# EAGLE design controle_com_2dimmer (EAGLE 6.4)

## Sheet 1 of 2
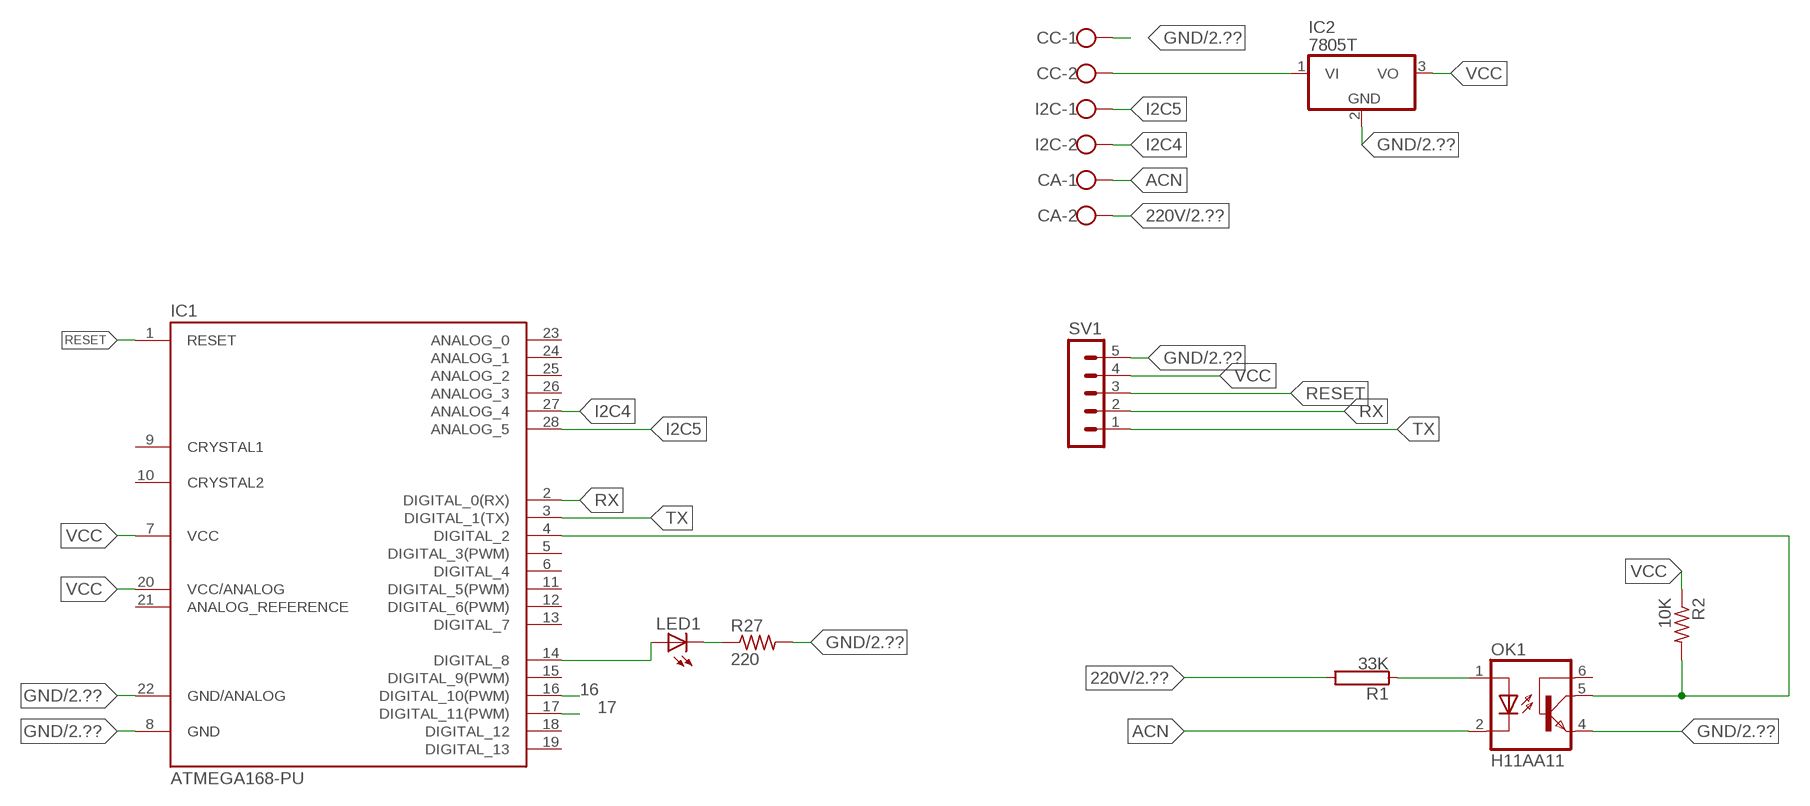
[diagram p0: schematic, sheet 1]

### Parts
CA  W237-102  [W237-102]
CC  W237-102  [W237-102]
I2C  W237-102  [W237-102]
IC1  ATMEGA168-PU  [DIL28-3]
IC2  7805T  [TO220H]
LED1  LED3MM  [LED3MM]
OK1  H11AA11  [DIL06]
R1  33K  RKH206-8R  [KH206-8R]
R2  10K  R-US_0207/7  [0207/7]
R27  220  R-US_0207/7  [0207/7]
SV1  MA05-1  [MA05-1]

### Nets
16: IC1.16(DIGITAL_10(PWM)) ; also sheet 2
17: IC1.17(DIGITAL_11(PWM)) ; also sheet 2
220V: CA.2 R1.2 ; also sheet 2
ACN: CA.1 OK1.2(C)
DIG02: IC1.4(DIGITAL_2) OK1.5(COL) R2.2
GND: CC.1 IC1.8(GND) IC1.22(GND/ANALOG) IC2.2(GND) OK1.4(EMI) R27.2 SV1.5 ; also sheet 2
I2C4: I2C.2 IC1.27(ANALOG_4)
I2C5: I2C.1 IC1.28(ANALOG_5)
N$6: OK1.1(A) R1.1
N$7: LED1.K(C) R27.1
N$12: CC.2 IC2.1(VI)
N$26: IC1.14(DIGITAL_8) LED1.A
RESET: IC1.1(RESET) SV1.3
RX: IC1.2(DIGITAL_0(RX)) SV1.2
TX: IC1.3(DIGITAL_1(TX)) SV1.1
VCC: IC1.7(VCC) IC1.20(VCC/ANALOG) IC2.3(VO) R2.1 SV1.4
Unconnected: IC1.5(DIGITAL_3(PWM)) IC1.6(DIGITAL_4) IC1.9(CRYSTAL1) IC1.10(CRYSTAL2) IC1.11(DIGITAL_5(PWM)) IC1.12(DIGITAL_6(PWM)) IC1.13(DIGITAL_7) IC1.15(DIGITAL_9(PWM)) IC1.18(DIGITAL_12) IC1.19(DIGITAL_13) IC1.21(ANALOG_REFERENCE) IC1.23(ANALOG_0) IC1.24(ANALOG_1) IC1.25(ANALOG_2) IC1.26(ANALOG_3) OK1.6(BAS)

## Sheet 2 of 2
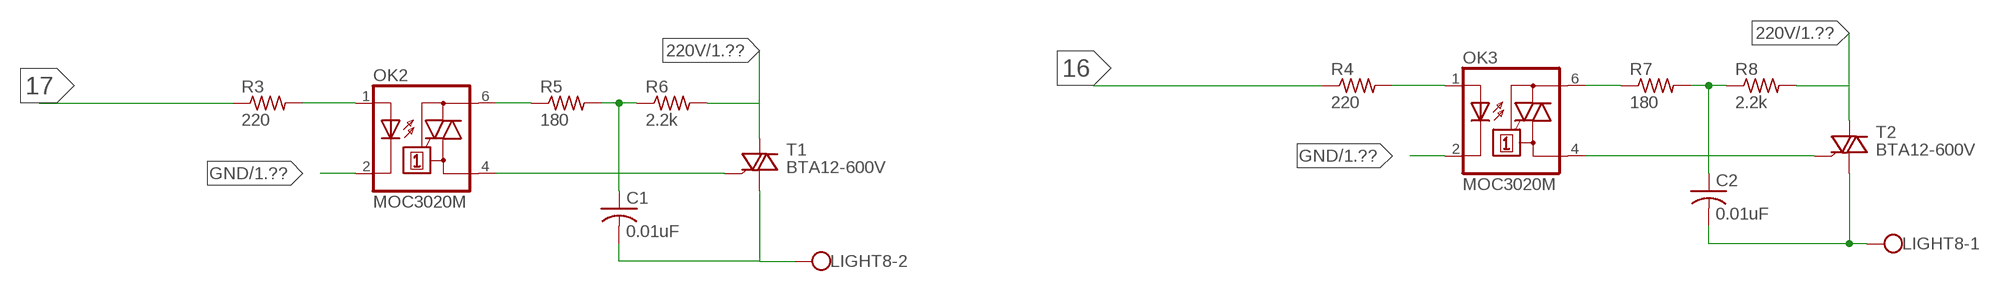
[diagram p1: schematic, sheet 2]

### Parts
C1  0.01uF  C-US075-042X103  [C075-042X103]
C2  0.01uF  C-US075-042X103  [C075-042X103]
LIGHT8  W237-102  [W237-102]
OK2  MOC3020M  [DIL06]
OK3  MOC3020M  [DIL06]
R3  220  R-US_0207/7  [0207/7]
R4  220  R-US_0207/7  [0207/7]
R5  180  R-US_0309/10  [0309/10]
R6  2.2k  R-US_0309/10  [0309/10]
R7  180  R-US_0309/10  [0309/10]
R8  2.2k  R-US_0309/10  [0309/10]
T1  BTA12-600V  [TO220V]
T2  BTA12-600V  [TO220V]

### Nets
16: R4.1 ; also sheet 1
17: R3.1 ; also sheet 1
220V: R6.2 R8.2 T1.2(A2) T2.2(A2) ; also sheet 1
GND: OK2.2(C) OK3.2(C) ; also sheet 1
N$2: OK3.1(A) R4.2
N$3: OK2.1(A) R3.2
N$5: C1.1 R5.2 R6.1
N$8: OK2.6(A2) R5.1
N$9: C1.2 LIGHT8.2 T1.1(A1)
N$10: OK2.4(A1) T1.3(G)
N$11: C2.1 R7.2 R8.1
N$13: OK3.6(A2) R7.1
N$14: C2.2 LIGHT8.1 T2.1(A1)
N$15: OK3.4(A1) T2.3(G)

## Library data of the parts
C1 C2 = adafruit:C-US: CAPACITOR, American symbol
CA CC I2C LIGHT8 = con-wago-500:W237-102: WAGO SCREW CLAMP; MPN: 237-102; OC_FARNELL: unknown; OC_NEWARK: 70K9898
IC1 = Arduino-AVR:ATMEGA168-PU
IC2 = linear:78*: Positive VOLTAGE REGULATOR Source: http://cache.national.com/ds/LM/LM78L05.pdf http://www.fairchildsemi.com/ds/LM/LM7805.pdf
LED1 = led:LED: LED OSRAM: - CHIPLED LG R971, LG N971, LY N971, LG Q971, LY Q971, LO R971, LY R971 LH N974, LH R974 LS Q976, LO Q976, LY Q976 LO Q996 - Hyper CHIPLED LW Q18S LB Q993, LB Q99A, LB R99A - SideLED LS A670, LO A670, LY A670, LG A670, LP A670 LB A673, LV A673, LT A673, LW A673 LH A674 LY A675 LS A676, LA A676, LO A676, LY A676, LW A676 LS A679, LY A679, LG A679 - Hyper Micro SIDELED® LS Y876, LA Y876, LO Y876, LY Y876 LT Y87S - SmartLED LW L88C, LW L88S LB L89C, LB L89S, LG L890 LS L89K, LO L89K, LY L89K LS L896, LA L896, LO L896, LY L896 - TOPLED LS T670, LO T670, LY T670, LG T670, LP T670 LSG T670, LSP T670, LSY T670, LOP T670, LYG T670 LG T671, LOG T671, LSG T671 LB T673, LV T673, LT T673, LW T673 LH T674 LS T676, LA T676, LO T676, LY T676, LB T676, LH T676, LSB T676, LW T676 LB T67C, LV T67C, LT T67C, LS T67K, LO T67K, LY T67K, LW E67C LS E67B, LA E67B, LO E67B, LY E67B, LB E67C, LV E67C, LT E67C LW T67C LS T679, LY T679, LG T679 LS T770, LO T770, LY T770, LG T770, LP T770 LB T773, LV T773, LT T773, LW T773 LH T774 LS E675, LA E675, LY E675, LS T675 LS T776, LA T776, LO T776, LY T776, LB T776 LHGB T686 LT T68C, LB T68C - Hyper Mini TOPLED® LB M676 - Mini TOPLED Santana® LG M470 LS M47K, LO M47K, LY M47K Source: http://www.osram.convergy.de LUXEON: - LUMILED® LXK2-PW12-R00, LXK2-PW12-S00, LXK2-PW14-U00, LXK2-PW14-V00 LXK2-PM12-R00, LXK2-PM12-S00, LXK2-PM14-U00 LXK2-PE12-Q00, LXK2-PE12-R00, LXK2-PE12-S00, LXK2-PE14-T00, LXK2-PE14-U00 LXK2-PB12-K00, LXK2-PB12-L00, LXK2-PB12-M00, LXK2-PB14-N00, LXK2-PB14-P00, LXK2-PB14-Q00 LXK2-PR12-L00, LXK2-PR12-M00, LXK2-PR14-Q00, LXK2-PR14-R00 LXK2-PD12-Q00, LXK2-PD12-R00, LXK2-PD12-S00 LXK2-PH12-R00, LXK2-PH12-S00 LXK2-PL12-P00, LXK2-PL12-Q00, LXK2-PL12-R00 Source: www.luxeon.com KINGBRIGHT: KA-3528ASYC Source: www.kingbright.com
OK1 = twomey:H11AA1: Optocoupler AC Input 1 Channel Trans W/Base DC Output 6-Pin DIP Source: http://www.jameco.com/webapp/wcs/stores/servlet/Product_10001_10001_18825_-1; MPN: H11A1-M; OC_FARNELL: 1021358; OC_NEWARK: 97K1793
OK2 OK3 = optocoupler:MOC30*M: RANDOM-PHASE OPTOISOLATORS TRIAC DRIVER OUTPUT Source: http://www.fairchildsemi.com MOC3020-M.pdf; MF: FAIRCHILD SEMICONDUCTOR; MPN: MOC3020-M; OC_FARNELL: 1505425; OC_NEWARK: 72K8895
R1 = resistor-power:R: Power Resitor; OC_FARNELL: unknown; OC_NEWARK: unknown
R2-R8 R27 = rcl:R-US_: RESISTOR, American symbol
SV1 = con-lstb:MA05-1: PIN HEADER; OC_FARNELL: unknown; OC_NEWARK: unknown
T1 T2 = twomey:BTA12-600: Thyristor TRIAC 600 Volt 126A 3-Pin (3+Tab) TO-220AB Isolated Tube Source: http://www.jameco.com/Jameco/Products/ProdDS/2034010.pdf

## Board
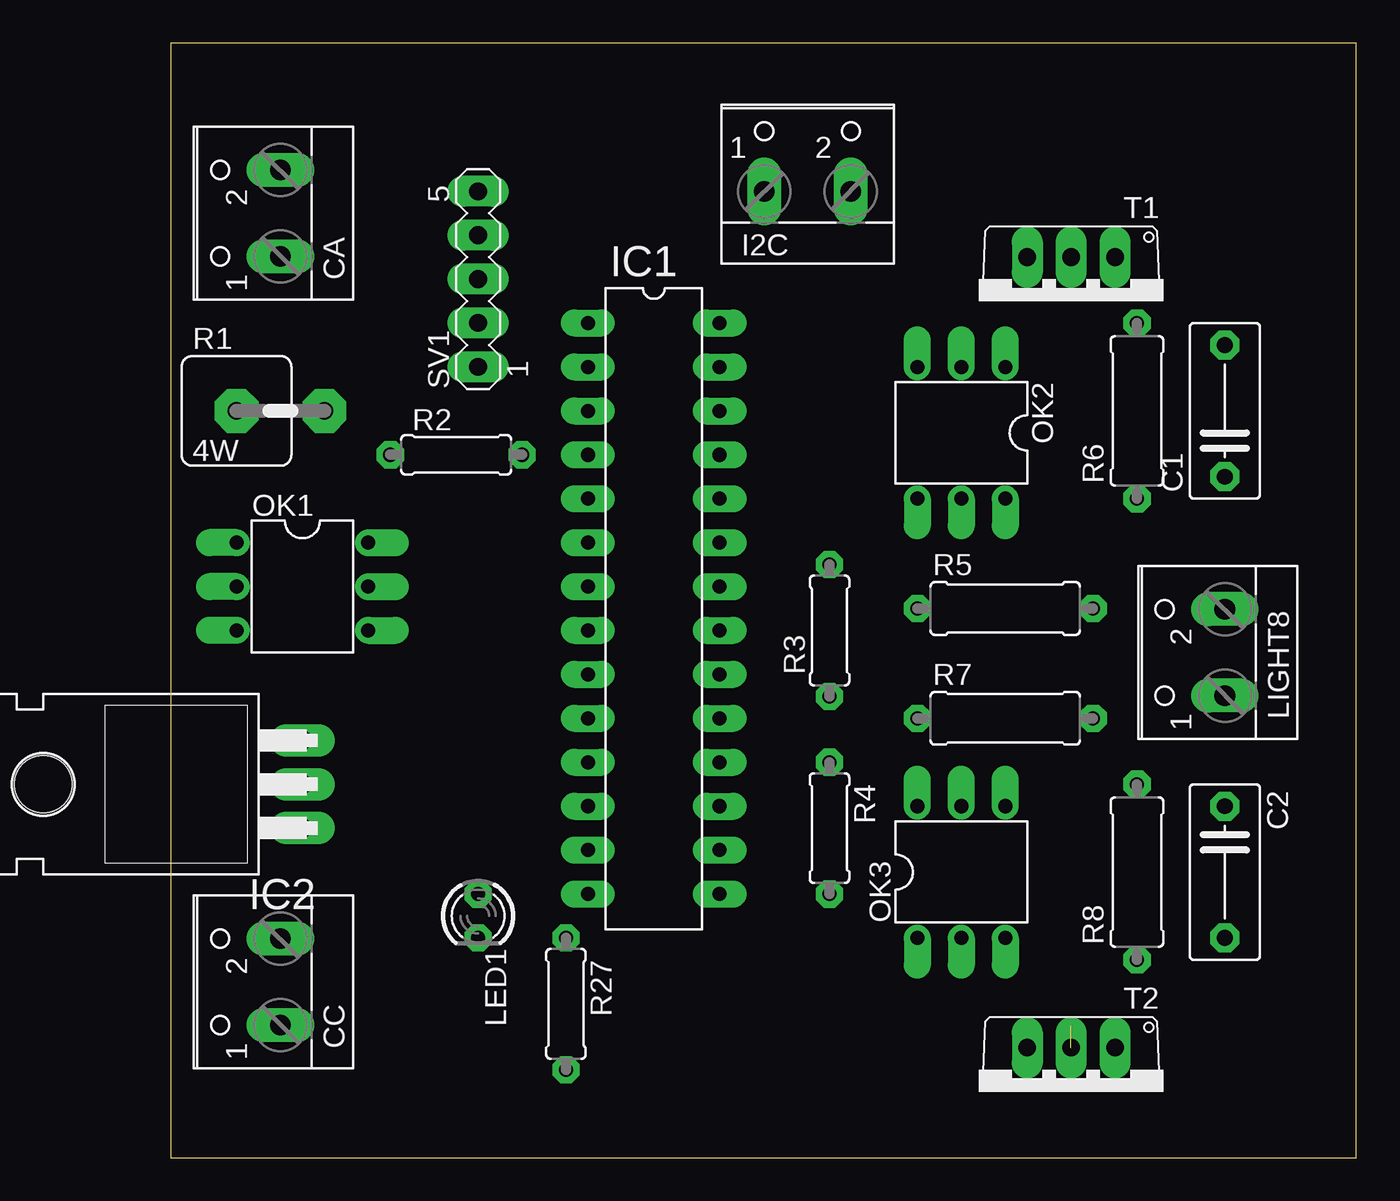
[diagram p2: board, top side]
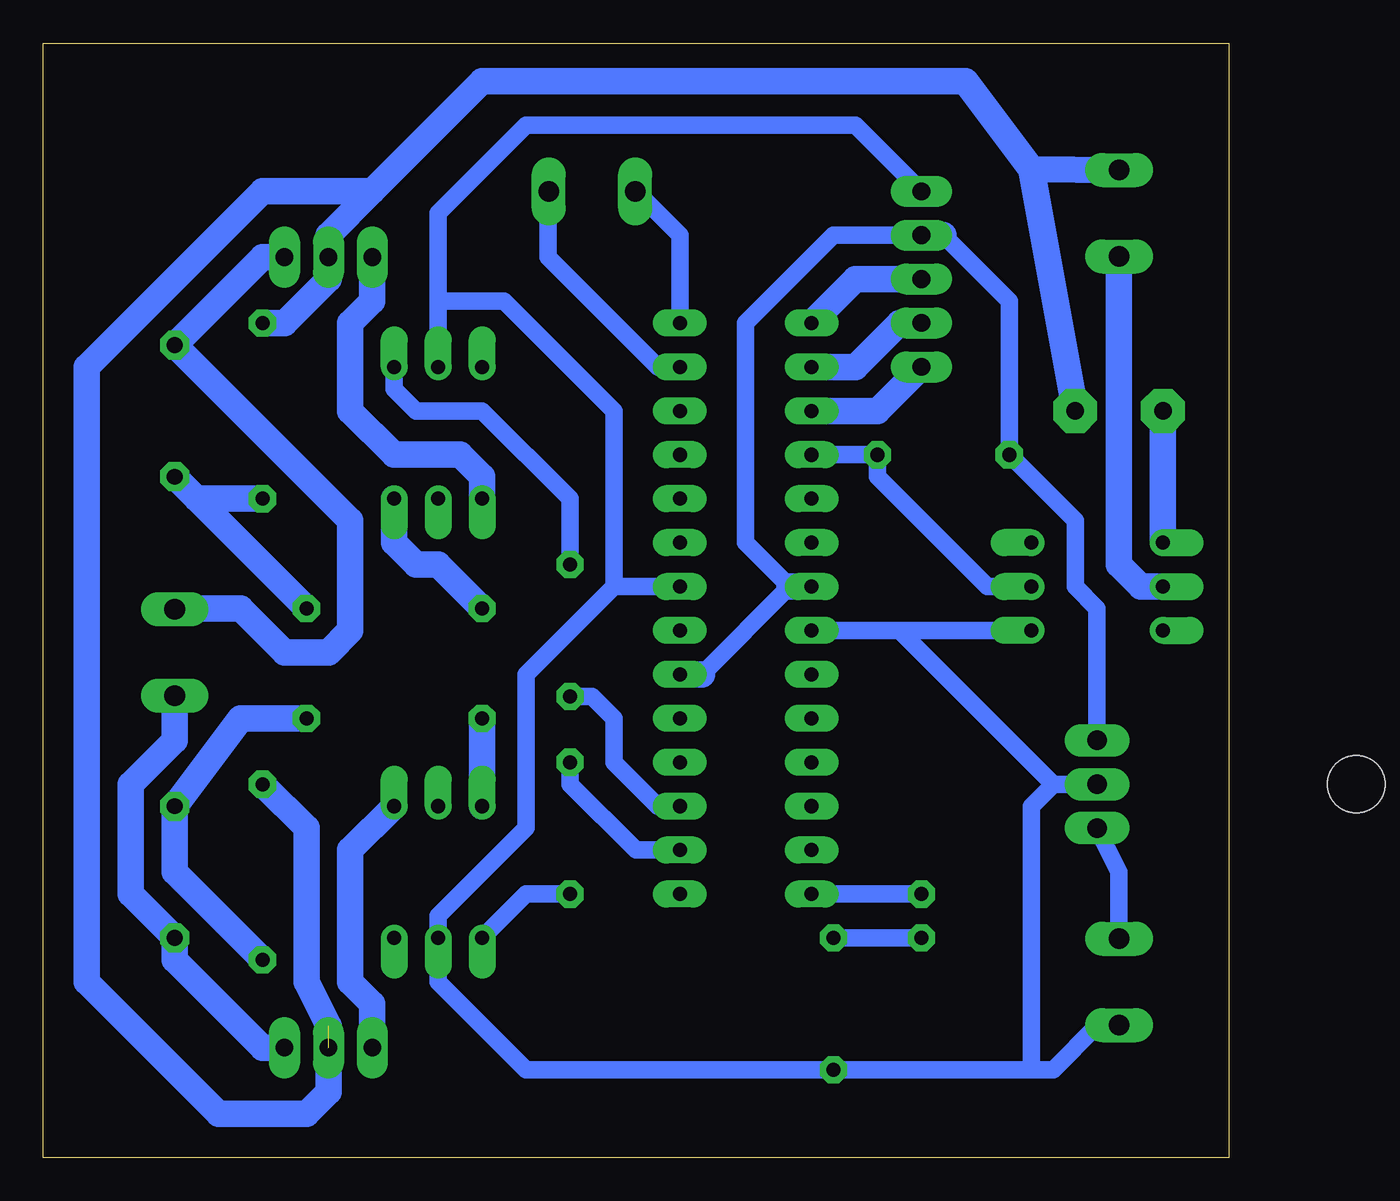
[diagram p3: board, bottom side, seen from below]

Size 68.56 x 64.44 mm. Coordinates in mm from the lower left corner, seen from the top.
Outline: 0,0 68.56,0 68.56,64.44 0,64.44 0,0
Copper layers (1*16): Top 0.035mm / dielectric 1.5mm / Bottom 0.035mm
Design rules "default *": minimum track width 40mil, minimum drill 24mil, track to track 15mil, track to pad 15mil, pad to pad 15mil, via to via 15mil, smd to smd 8mil, copper to edge 40mil, drill to drill 8mil, minimum pad ring 15mil, minimum via ring 8mil, stop-mask expansion 4mil, vias tented up to drill 0mil, thermal gap 10mil

### Footprints (pad centres in the part's own frame; a part is rotated, then mirrored left to right if it is on the bottom)
C075-042X103 = drill 0.914 octagon: 1 -3.81,0; 2 3.81,0
W237-102 = drill 1.194 long: 1 -2.5,-1.27; 2 2.5,-1.27
DIL28-3 = drill 0.813 long: 1 -16.51,-3.81; 2 -13.97,-3.81; 3 -11.43,-3.81; 4 -8.89,-3.81; 5 -6.35,-3.81; 6 -3.81,-3.81; 7 -1.27,-3.81; 8 1.27,-3.81; 9 3.81,-3.81; 10 6.35,-3.81; 11 8.89,-3.81; 12 11.43,-3.81; 13 13.97,-3.81; 14 16.51,-3.81; 15 16.51,3.81; 16 13.97,3.81; 17 11.43,3.81; 18 8.89,3.81; 19 6.35,3.81; 20 3.81,3.81; 21 1.27,3.81; 22 -1.27,3.81; 23 -3.81,3.81; 24 -6.35,3.81; 25 -8.89,3.81; 26 -11.43,3.81; 27 -13.97,3.81; 28 -16.51,3.81
TO220H = drill 1.118 long: 1 -2.54,-10.16; 2 0,-10.16; 3 2.54,-10.16 | hole 3.302: 0,4.826
LED3MM = drill 0.813 octagon: A -1.27,0; K 1.27,0
DIL06 = drill 0.813 offset: 1 -2.54,-3.81; 2 0,-3.81; 3 2.54,-3.81; 4 2.54,3.81; 5 0,3.81; 6 -2.54,3.81
KH206-8R = drill 1.016 pad 2.54 octagon: 1 -2.54,0; 2 2.54,0
0207/7 = drill 0.813 octagon: 1 -3.81,0; 2 3.81,0
0309/10 = drill 0.813 octagon: 1 -5.08,0; 2 5.08,0
MA05-1 = drill 1.016 long: 1 -5.08,0; 2 -2.54,0; 3 0,0; 4 2.54,0; 5 5.08,0
TO220V = drill 1.016 long: 1 -2.54,-2.54; 2 0,-2.54; 3 2.54,-2.54

### Placement (x,y rotation side)
C1  60.96,43.18 90 top
C2  60.96,16.51 270 top
CA  5.08,54.61 90 top
CC  5.08,10.16 90 top
I2C  36.83,57.15 0 top
IC1  27.94,31.75 270 top
IC2  -2.54,21.59 90 top
LED1  17.78,13.97 270 top
LIGHT8  59.69,29.21 90 top
OK1  7.62,33.02 270 top
OK2  45.72,41.91 180 top
OK3  45.72,16.51 0 top
R1  6.35,43.18 0 top
R2  16.51,40.64 0 top
R3  38.1,30.48 90 top
R4  38.1,19.05 270 top
R5  48.26,31.75 0 top
R6  55.88,43.18 90 top
R7  48.26,25.4 0 top
R8  55.88,16.51 90 top
R27  22.86,8.89 270 top
SV1  17.78,50.8 90 top
T1  52.07,49.53 180 top
T2  52.07,3.81 180 top

### Tracks (layer width: path | path; a pad name or v marks a point on that pad's centre or on a via)
16
  Bottom 1.016: IC1.16 34.29,17.78 38.1,21.59 R4.1
17
  Bottom 1.016: IC1.17 33.02,20.32 35.56,22.86 35.56,25.4 36.83,26.67 R3.1
220V  (1 unrouted)
  Bottom 1.524: R6.2 54.61,48.26 52.07,50.8 T1.2 52.07,53.34 49.53,55.88 | R1.2 11.43,57.15 | 49.53,55.88 43.18,62.23 15.24,62.23 11.43,57.15 | 11.43,57.15 CA.2 | 49.53,55.88 55.88,55.88 66.04,45.72 66.04,10.16 58.42,2.54 53.34,2.54 52.07,3.81 T2.2 | 52.07,7.62 53.34,10.16 53.34,19.05 R8.2
ACN
  Bottom 1.524: OK1.2 5.08,33.02 6.35,34.29 CA.1
DIG02
  Bottom 1.016: OK1.5 13.97,33.02 20.32,39.37 R2.2 IC1.4
GND
  Bottom 1.016: 45.72,49.53 45.72,54.61 40.64,59.69 21.59,59.69 SV1.5 | 45.72,49.53 OK2.2 | IC1.8 19.05,30.48 | 19.05,30.48 OK1.4 | 10.16,21.59 IC2.2 | 19.05,30.48 10.16,21.59 | 11.43,5.08 10.16,5.08 7.62,7.62 CC.1 | 11.43,5.08 R27.2 40.64,5.08 45.72,10.16 OK3.2 45.72,13.97 40.64,19.05 40.64,27.94 35.56,33.02 | 35.56,33.02 IC1.22 | 10.16,21.59 11.43,20.32 11.43,5.08 | 45.72,49.53 41.91,49.53 35.56,43.18 35.56,33.02
I2C4
  Bottom 1.016: IC1.27 33.02,45.72 39.37,52.07 39.37,55.88
  Bottom 1.524: 39.37,55.88 I2C.2
I2C5
  Bottom 1.016: IC1.28 31.75,53.34 34.29,55.88
  Bottom 1.524: 34.29,55.88 I2C.1
N$2
  Bottom 1.016: R4.2 40.64,15.24 OK3.1
N$3
  Bottom 1.016: R3.2 38.1,38.1 43.18,43.18 46.99,43.18 48.26,44.45 OK2.1
N$5
  Bottom 1.524: C1.1 59.69,38.1 | 59.69,38.1 R5.2 | 59.69,38.1 R6.1
N$6
  Bottom 1.524: R1.1 OK1.1
N$7
  Bottom 1.016: R27.1 LED1.K
N$8
  Bottom 1.524: R5.1 45.72,34.29 46.99,34.29 48.26,35.56 OK2.6
N$9
  Bottom 1.524: T1.1 55.88,52.07 C1.2 50.8,36.83 50.8,30.48 52.07,29.21 54.61,29.21 57.15,31.75 60.96,31.75 LIGHT8.2
N$10
  Bottom 1.524: OK2.4 43.18,39.37 44.45,40.64 48.26,40.64 50.8,43.18 50.8,48.26 49.53,49.53 T1.3
N$11
  Bottom 1.524: R7.2 57.15,25.4 C2.1 60.96,16.51 R8.1
N$12
  Bottom 1.016: IC2.1 6.35,16.51 CC.2
N$13
  Bottom 1.524: R7.1 OK3.6
N$14
  Bottom 1.524: LIGHT8.1 60.96,24.13 63.5,21.59 63.5,15.24 C2.2 60.96,11.43 55.88,6.35 T2.1
N$15
  Bottom 1.524: T2.3 49.53,8.89 50.8,10.16 50.8,17.78 OK3.4
N$26
  Bottom 1.016: IC1.14 LED1.A
RESET
  Bottom 1.524: IC1.1 21.59,50.8 SV1.3
RX
  Bottom 1.524: IC1.2 21.59,45.72 19.05,48.26 SV1.2
TX
  Bottom 1.524: IC1.3 20.32,43.18 SV1.1
VCC
  Bottom 1.016: 30.48,27.94 25.4,33.02 27.94,35.56 27.94,48.26 22.86,53.34 SV1.4 | 16.51,53.34 12.7,49.53 R2.1 8.89,36.83 8.89,33.02 7.62,31.75 IC2.3
  Bottom 1.524: IC1.20 30.48,27.94 | SV1.4 16.51,53.34 | 25.4,33.02 IC1.7